# Altium schematic sheet Clock_Sch.SchDoc
size 410 x 297 mm; ApprovedBy: Утвердил; CheckedBy: Проверил; Author: Разработал; SheetNumber: Лист; SheetTotal: Листов; PageSetup: Record=PageOptions|CenterHorizontal=True|CenterVertical=True|PrintScale=1.00|XCorrection=1.00|YCorrection=1.00|PrintKind=1|BorderSize=5000000|LeftOffset=0|BottomOffset=0|Orientation=2|PaperLength=1000|PaperWidth=1000|Scale=100|PaperSource=15|PrintQuality=1200|MediaType=1|DitherType=10|PaperKind=A3|PrintScaleMode=1; Weight: -; ScaleFactor: -; NormInspection: Норм.Контр.
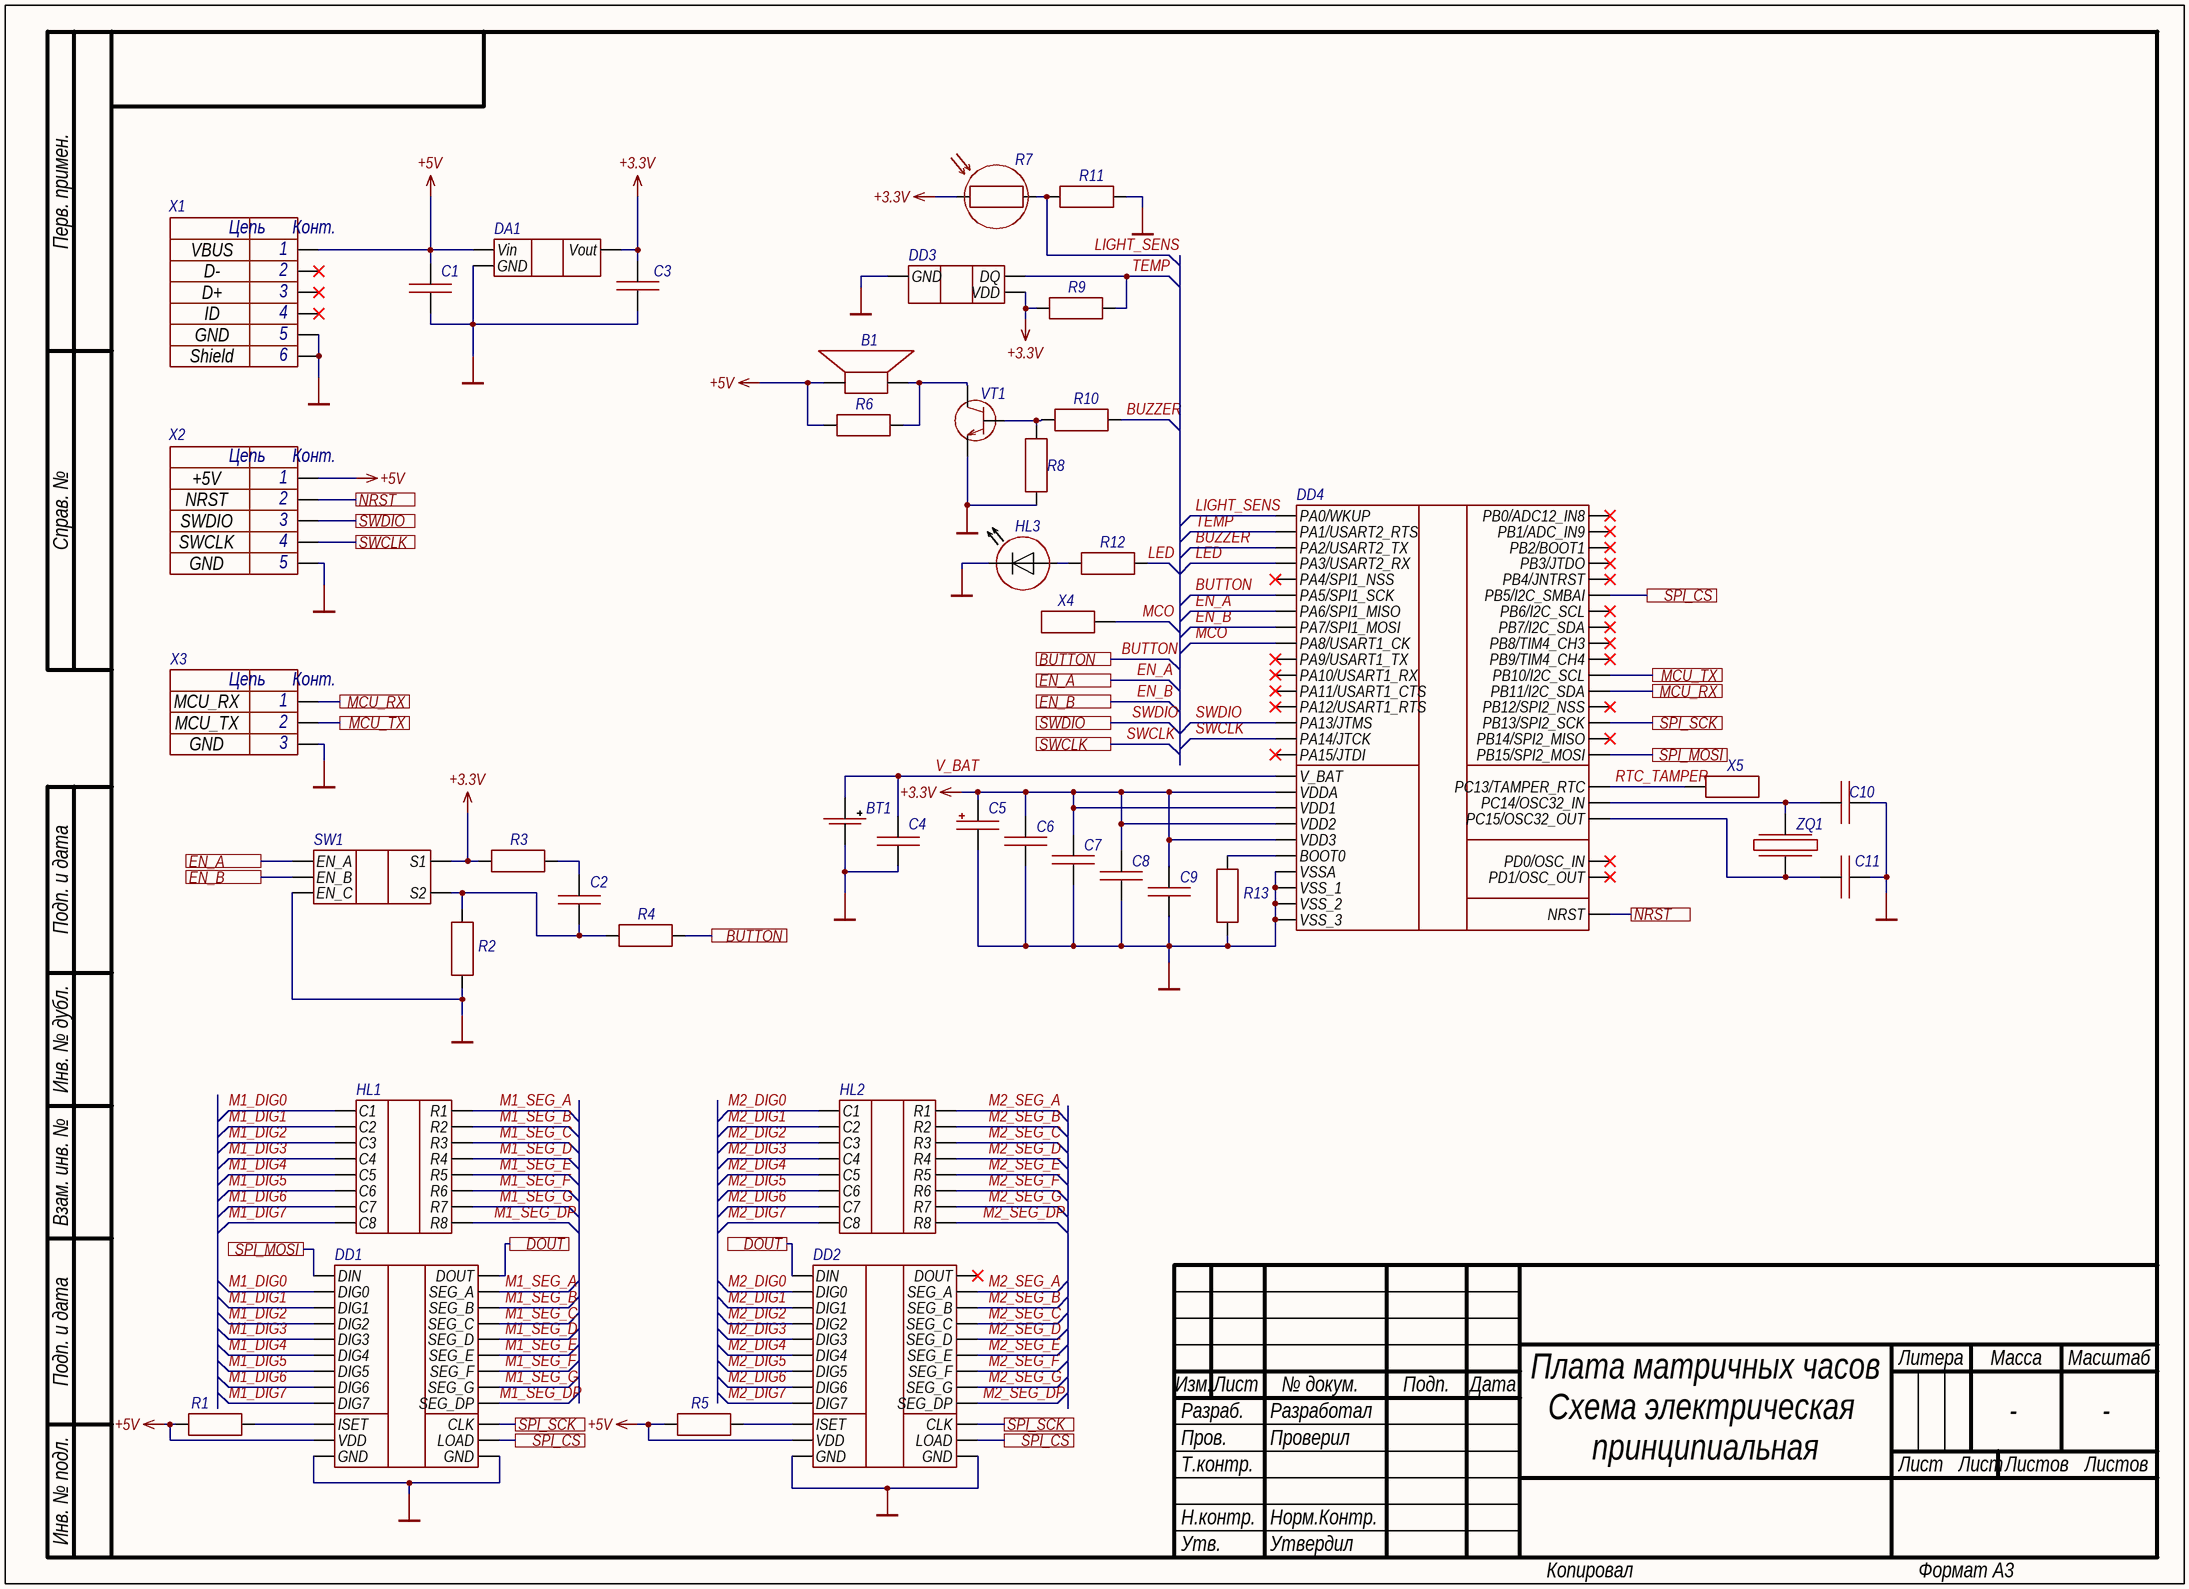
[diagram p0: Clock_Sch.SchDoc]

## Parts
B1  AI-1223-TWT-12V-R  [Buzzer_12mm]  (value not drawn)
BT1  CR-2032/F2N  [CR2032/F2N]  (value not drawn)
C1  C0603C334K4RACTU  [CAP_0603]  (value not drawn)
C2  C0603C104K9RACTU  [CAP_0603]  (value not drawn)
C3  C0603C104K9RACTU  [CAP_0603]  (value not drawn)
C4  C0603C104K9RACTU  [CAP_0603]  (value not drawn)
C5  T491A475K025AH  [CAP_A]  (value not drawn)
C6  C0603C104K9RACTU  [CAP_0603]  (value not drawn)
C7  C0603C104K9RACTU  [CAP_0603]  (value not drawn)
C8  C0603C104K9RACTU  [CAP_0603]  (value not drawn)
C9  C0603C104K9RACTU  [CAP_0603]  (value not drawn)
C10  C0603C220G8GACTU  [CAP_0603]  (value not drawn)
C11  C0603C220G8GACTU  [CAP_0603]  (value not drawn)
DA1  L78L33ABUTR  [SOT-89]  (value not drawn)
DD1  MAX7219CWG  [SOIC-24W]  (value not drawn)
DD2  MAX7219CWG  [SOIC-24W]  (value not drawn)
DD3  DS18B20+  [TO-92]  (value not drawn)
DD4  STM32F103C8T6  [LQFP48]  (value not drawn)
HL1  TC15-11GWA  [TC15-11]  (value not drawn)
HL2  TC15-11GWA  [TC15-11]  (value not drawn)
HL3  L_0805  [L_0805_Green]  (value not drawn)
R1  RC0805FR-0739KL  [Res_0805]  (value not drawn)
R2  RC0805FR-071KL  [Res_0805]  (value not drawn)
R3  RC0805FR-07220RL  [Res_0805]  (value not drawn)
R4  RC0805FR-07220RL  [Res_0805]  (value not drawn)
R5  RC0805FR-0739KL  [Res_0805]  (value not drawn)
R6  RC0805FR-071KL  [Res_0805]  (value not drawn)
R7  02-LDR2  [5mm LDR]  (value not drawn)
R8  RC0805FR-0710KL  [Res_0805]  (value not drawn)
R9  RC0805FR-074K7L  [Res_0805]  (value not drawn)
R10  RC0805FR-071KL  [Res_0805]  (value not drawn)
R11  RC0805FR-0710KL  [Res_0805]  (value not drawn)
R12  RC0805FR-071KL  [Res_0805]  (value not drawn)
R13  RC0805FR-071KL  [Res_0805]  (value not drawn)
SW1  EC12D1564402  [EC12D]  (value not drawn)
VT1  BC817  [SOT-23]  (value not drawn)
X1  47346-0001  [47346-0001]  (value not drawn)
X2  PLS-5R (DS1022-1x5R)  [PLS-5 90' angle]  (value not drawn)
X3  PLS-3 (DS1021-1x3)  [PLS-3]  (value not drawn)
X4  1-0.8-14-04  [1-0.8-14-04]  (value not drawn)
X5  1-0.8-14-04  [1-0.8-14-04]  (value not drawn)
ZQ1  MCRJ332768F1220HOW  [DT-38]  (value not drawn)

## Ports
BUTTON, DOUT, EN_A, EN_B, MCU_RX, MCU_TX, NRST, SPI_CS, SPI_MOSI, SPI_SCK, SWCLK, SWDIO

## Nets
+3.3V: C3.2 C5.1 C6.2 C7.2 C8.2 C9.2 DA1.1(Vout) DD3.3(VDD) DD4.9(VDDA) DD4.24(VDD1) DD4.36(VDD2) DD4.48(VDD3) R3.1 R7.2 R9.2 SW1.D(S1)
+5V: B1.1 C1.2 DA1.3(Vin) DD1.19(VDD) DD2.19(VDD) R1.1 R5.1 R6.1 X1.1(VBUS) X2.1
GND: BT1.2(-) C1.1 C3.1 C4.1 C5.2 C6.1 C7.1 C8.1 C9.1 C10.1 C11.1 DA1.2(GND) DD1.4(GND) DD1.9(GND) DD2.4(GND) DD2.9(GND) DD3.1(GND) DD4.8(VSSA) DD4.23(VSS_1) DD4.35(VSS_2) DD4.47(VSS_3) HL3.2(-) R2.1 R8.1 R11.1 R13.1 SW1.C(EN_C) VT1.2(Emitter) X1.5(GND) X1.6(Shield) X2.5 X3.3
BUTTON: DD4.15(PA5/SPI1_SCK) R4.2 ; port BUTTON
BUZZER: DD4.12(PA2/USART2_TX) R10.2
DOUT: DD1.24(DOUT) DD2.1(DIN) ; port DOUT
EN_A: DD4.16(PA6/SPI1_MISO) SW1.A(EN_A) ; port EN_A
EN_B: DD4.17(PA7/SPI1_MOSI) SW1.B(EN_B) ; port EN_B
LED: DD4.13(PA3/USART2_RX) R12.2
LIGHT_SENS: DD4.10(PA0/WKUP) R7.1 R11.2
M1_DIG0: DD1.2(DIG0) HL1.13(С1)
M1_DIG1: DD1.11(DIG1) HL1.3(С2)
M1_DIG2: DD1.6(DIG2) HL1.4(С3)
M1_DIG3: DD1.7(DIG3) HL1.10(С4)
M1_DIG4: DD1.3(DIG4) HL1.6(С5)
M1_DIG5: DD1.10(DIG5) HL1.11(С6)
M1_DIG6: DD1.5(DIG6) HL1.15(С7)
M1_DIG7: DD1.8(DIG7) HL1.16(С8)
M1_SEG_A: DD1.14(SEG_A) HL1.9(R1)
M1_SEG_B: DD1.16(SEG_B) HL1.14(R2)
M1_SEG_C: DD1.20(SEG_C) HL1.8(R3)
M1_SEG_D: DD1.23(SEG_D) HL1.12(R4)
M1_SEG_DP: DD1.22(SEG_DP) HL1.5(R8)
M1_SEG_E: DD1.21(SEG_E) HL1.1(R5)
M1_SEG_F: DD1.15(SEG_F) HL1.7(R6)
M1_SEG_G: DD1.17(SEG_G) HL1.2(R7)
M2_DIG0: DD2.2(DIG0) HL2.13(С1)
M2_DIG1: DD2.11(DIG1) HL2.3(С2)
M2_DIG2: DD2.6(DIG2) HL2.4(С3)
M2_DIG3: DD2.7(DIG3) HL2.10(С4)
M2_DIG4: DD2.3(DIG4) HL2.6(С5)
M2_DIG5: DD2.10(DIG5) HL2.11(С6)
M2_DIG6: DD2.5(DIG6) HL2.15(С7)
M2_DIG7: DD2.8(DIG7) HL2.16(С8)
M2_SEG_A: DD2.14(SEG_A) HL2.9(R1)
M2_SEG_B: DD2.16(SEG_B) HL2.14(R2)
M2_SEG_C: DD2.20(SEG_C) HL2.8(R3)
M2_SEG_D: DD2.23(SEG_D) HL2.12(R4)
M2_SEG_DP: DD2.22(SEG_DP) HL2.5(R8)
M2_SEG_E: DD2.21(SEG_E) HL2.1(R5)
M2_SEG_F: DD2.15(SEG_F) HL2.7(R6)
M2_SEG_G: DD2.17(SEG_G) HL2.2(R7)
MCO: DD4.29(PA8/USART1_CK) X4.1
MCU_RX: DD4.22(PB11/I2C_SDA) X3.1 ; port MCU_RX
MCU_TX: DD4.21(PB10/I2C_SCL) X3.2 ; port MCU_TX
NRST: DD4.7(NRST) X2.2 ; port NRST
RTC_TAMPER: DD4.2(PC13/TAMPER_RTC) X5.1
SPI_CS: DD1.12(LOAD) DD2.12(LOAD) DD4.41(PB5/I2C_SMBAI) ; port SPI_CS
SPI_MOSI: DD1.1(DIN) DD4.28(PB15/SPI2_MOSI) ; port SPI_MOSI
SPI_SCK: DD1.13(CLK) DD2.13(CLK) DD4.26(PB13/SPI2_SCK) ; port SPI_SCK
SWCLK: DD4.37(PA14/JTCK) X2.4 ; port SWCLK
SWDIO: DD4.34(PA13/JTMS) X2.3 ; port SWDIO
TEMP: DD3.2(DQ) DD4.11(PA1/USART2_RTS) R9.1
V_BAT: BT1.1(+) C4.2 DD4.1(V_BAT)
NetB1_2: B1.2 R6.2 VT1.3(Collector)
NetC2_1: C2.1 R2.2 R4.1 SW1.E(S2)
NetC2_2: C2.2 R3.2
NetC10_2: C10.2 DD4.3(PC14/OSC32_IN) ZQ1.2
NetC11_2: C11.2 DD4.4(PC15/OSC32_OUT) ZQ1.1
NetDD1_18: DD1.18(ISET) R1.2
NetDD2_18: DD2.18(ISET) R5.2
NetDD4_44: DD4.44(BOOT0) R13.2
NetHL3_1: HL3.1(+) R12.1
NetR8_2: R8.2 R10.1 VT1.1(BASE)

Not connected (* = marked no-connect by the designer): DD2 24(DOUT)*; DD4 5(PD0/OSC_IN)* 6(PD1/OSC_OUT)* 14(PA4/SPI1_NSS)* 18(PB0/ADC12_IN8)* 19(PB1/ADC_IN9)* 20(PB2/BOOT1)* 25(PB12/SPI2_NSS)* 27(PB14/SPI2_MISO)* 30(PA9/USART1_TX)* 31(PA10/USART1_RX)* 32(PA11/USART1_CTS)* 33(PA12/USART1_RTS)* 38(PA15/JTDI)* 39(PB3/JTDO)* 40(PB4/JNTRST)* 42(PB6/I2C_SCL)* 43(PB7/I2C_SDA)* 45(PB8/TIM4_CH3)* 46(PB9/TIM4_CH4)*; X1 2(D-)* 3(D+)* 4(ID)*

## Notes on the sheet
- +5V
- NRST
- SWDIO
- SWCLK
- GND
- MCU_RX
- MCU_TX
- Плата матричных часов
  Схема электрическая
  принципиальная
- Перв. примен.
- Справ. №
- Подп. и дата
- Инв. № дубл.
- Взам. инв. №
- Разраб.
- Изм.
- Лист
- № докум.
- Подп.
- Дата
- Литера
- Масса
- Масштаб
- Пров.
- Т.контр.
- Листов
- Инв. № подл.
- Н.контр.
- Утв.
- Копировал
- Формат А3
- (in symbol 47346-0001) Цепь; Конт.
- (in symbol PLS-3 (DS1021-1x3)) Цепь; Конт.
- (in symbol PLS-5R (DS1022-1x5R)) Цепь; Конт.

## Library data of the parts
B1 = AI-1223-TWT-12V-R: ELECTRO-MECHANICAL AUDIO INDICATOR; ComponentLink1Description: Datasheet; ComponentLink1URL: https://www.snapeda.com/parts/AI-1223-TWT-12V-R/PUI%20Audio,/datasheet/; Supplier 1: Digi-Key; Supplier Part Number 1: 668-1018-ND
BT1 = CR-2032/F2N: Coin, 20.0mm Lithium Manganese Dioxide 3 V Battery Non-Rechargeable (Primary); ComponentLink1Description: Datasheet; ComponentLink1URL: https://www.snapeda.com/parts/CR-2032/F2N/Panasonic%20-%20BSG/datasheet/; Supplier 1: RSComponents; Supplier Part Number 1: 1839490
C1 = C0603C334K4RACTU: 0.33 µF ±10% 16V Ceramic Capacitor X7R 0603 (1608 Metric); ComponentLink1Description: Datasheet; ComponentLink1URL: https://www.snapeda.com/parts/C0603C334K4RACTU/KEMET/datasheet/; Supplier 1: RSComponents; Supplier Part Number 1: 0147522
C2-C4 C6-C9 = C0603C104K9RACTU: 0.1 µF ±10% 6.3V Ceramic Capacitor X7R 0603 (1608 Metric); ComponentLink1Description: Datasheet; ComponentLink1URL: *https://www.snapeda.com/parts/C0603C104K9RACTU/KEMET/datasheet/; Supplier 1: Arrow Electronics; Supplier Part Number 1: C0603C104K9RACTU
C5 = T491A475K025AH: 4.7uF 25V A CASE 10% (3.2 X 1.6 X 1.6mm) Inward L SMD 3216-18 6 Ohm 125°C Automotive T/R; ComponentLink1Description: Datasheet; ComponentLink1URL: https://www.snapeda.com/parts/T491A475K025AH/KEMET/datasheet/; Supplier 1: Newark; Supplier Part Number 1: 09P0870
C10 C11 = C0603C220G8GACTU: 22 pF ± 2% 10V Ceramic Capacitor 0603 (1608 metric); ComponentLink1Description: Datasheet; ComponentLink1URL: https://www.snapeda.com/parts/C0603C220G8GACTU/KEMET/datasheet/; Supplier 1: Avnet; Supplier Part Number 1: C0603C220G8GACTU
DA1 = L78L33ABUTR: Linear Voltage Regulators 3.3V 0.1A Positive; ComponentLink1Description: Datasheet; ComponentLink1URL: https://www.st.com/content/ccc/resource/technical/document/datasheet/15/55/e5/aa/23/5b/43/fd/CD00000446.pdf/files/CD00000446.pdf/jcr:content/translations/en.CD00000446.pdf; Supplier 1: Arrow Electronics; Supplier Part Number 1: L78L33ABUTR
DD1 DD2 = MAX7219CWG: LED Display Drivers Serially Interfaced, 8-Digit, LED Display Drivers; ComponentLink1Description: Datasheet; ComponentLink1URL: https://eu.mouser.com/datasheet/2/256/MAX7219_MAX7221-1513157.pdf; Supplier 1: Arrow Electronics; Supplier Part Number 1: MAX7219CWG+
DD3 = DS18B20+: Thermostats Programmable Resolution 1-Wire Digital Thermometer; ComponentLink1Description: Datasheet; ComponentLink1URL: https://eu.mouser.com/datasheet/2/256/DS18B20-370043.pdf; Supplier 1: Newark; Supplier Part Number 1: 73Y1389
DD4 = STM32F103C8T6: ARM Microcontrollers - MCU 32BIT Cortex M3 64KB 20KB RAM 2X12 ADC; ComponentLink1Description: Datasheet; ComponentLink1URL: https://eu.mouser.com/datasheet/2/389/stm32f103c8-1851025.pdf; Supplier 1: Newark; Supplier Part Number 1: 59M2182
HL1 HL2 = TC15-11GWA: LED Displays & Accessories Dot Matrix Grn 568nm Common Cathode; ComponentLink1Description: Datasheet; ComponentLink1URL: https://eu.mouser.com/datasheet/2/216/TC15-11GWA-66890.pdf; Supplier 1: Mouser; Supplier Part Number 1: 604-TC15-11GWA
HL3 = L_0805: 0805 SMD LED
R1 R5 = RC0805FR-0739KL: 39 kOhm, 1% 0.125W 0805; Supplier 1: Arrow Electronics; Supplier Part Number 1: RC0805FR-0739KL; ComponentLink1Description: Datasheet; ComponentLink1URL: https://static.chipdip.ru/lib/174/DOC011174980.pdf
R2 R6 R10 R12 R13 = RC0805FR-071KL: 1 kOhm, 1% 0.125W 0805; Supplier 1: Arrow Electronics; Supplier Part Number 1: RC0805FR-071KL; ComponentLink1Description: Datasheet; ComponentLink1URL: https://static.chipdip.ru/lib/174/DOC011174980.pdf
R3 R4 = RC0805FR-07220RL: 220 Ohm, 1% 0.125W 0805; Supplier 1: Arrow Electronics; Supplier Part Number 1: RC0805FR-07220RL; ComponentLink1Description: Datasheet; ComponentLink1URL: https://static.chipdip.ru/lib/174/DOC011174980.pdf
R7 = 02-LDR2: Photoresistor - 90mW - Light Resistance (10 Lux) 5 − 10Kohm - Dark Resistance 0.5Kohm - 5mm Dia; ComponentLink1Description: Datasheet; ComponentLink1URL: https://s3.amazonaws.com/snapeda/datasheet/02-LDR2_NTE_Electronics-_Inc.pdf; Supplier 1: Allied Electronics; Supplier Part Number 1: 72092161
R8 R11 = RC0805FR-0710KL: 10 kOhm, 1% 0.125W 0805; ComponentLink1Description: Datasheet; ComponentLink1URL: https://static.chipdip.ru/lib/174/DOC011174980.pdf; Supplier 1: Arrow Electronics; Supplier Part Number 1: RC0805FR-0710KL
R9 = RC0805FR-074K7L: 4.7 kOhm, 1% 0.125W 0805; Supplier 1: Arrow Electronics; Supplier Part Number 1: RC0805FR-074K7L; ComponentLink1Description: Datasheet; ComponentLink1URL: https://static.chipdip.ru/lib/174/DOC011174980.pdf
SW1 = EC12D1564402: Encoder: incremental; Mounting: THT; 15imp/revol; 30000cycles; Supplier 1: Newark; Supplier Part Number 1: 75T6730; ComponentLink1Description: Datasheet; ComponentLink1URL: https://www.snapeda.com/parts/EC12D1564402/ALPS/datasheet/
VT1 = BC817: Bipolar Transistors - BJT SOT23,NPN,0.8A,45V,GenPur; ComponentLink1Description: Datasheet; ComponentLink1URL: https://eu.mouser.com/datasheet/2/345/bc817-2449263.pdf; Supplier 1: Arrow Electronics; Supplier Part Number 1: BC817-40LT1G
X1 = 47346-0001: USB - micro B USB 2.0 Receptacle Connector 5 Position Surface Mount, Right Angle; ComponentLink1Description: Datasheet; ComponentLink1URL: https://www.snapeda.com/parts/47346-0001/Molex/datasheet/; Supplier 1: Arrow Electronics; Supplier Part Number 1: 47346-0001
X2 = PLS-5R (DS1022-1x5R): Male plug 2.54mm 1х5pin angled; ComponentLink1Description: Datasheet; ComponentLink1URL: https://static.chipdip.ru/lib/468/DOC002468246.pdf
X3 = PLS-3 (DS1021-1x3): Male plug 2.54mm 1x3pin straight type1; ComponentLink1Description: Datasheet; ComponentLink1URL: https://static.chipdip.ru/lib/977/DOC005977245.pdf
X4 X5 = 1-0.8-14-04: ГОСТ 16840-78; ComponentLink1Description: New link; ComponentLink1URL: https://static.chipdip.ru/lib/394/DOC001394265.pdf
ZQ1 = MCRJ332768F1220HOW: 32.768kHz Crystal Resonator; Supplier 1: Newark; Supplier Part Number 1: 56P2824; ComponentLink1Description: Datasheet; ComponentLink1URL: https://static.chipdip.ru/lib/862/DOC011862235.pdf